# Altium schematic sheet Stack_B.SchDoc
size A4
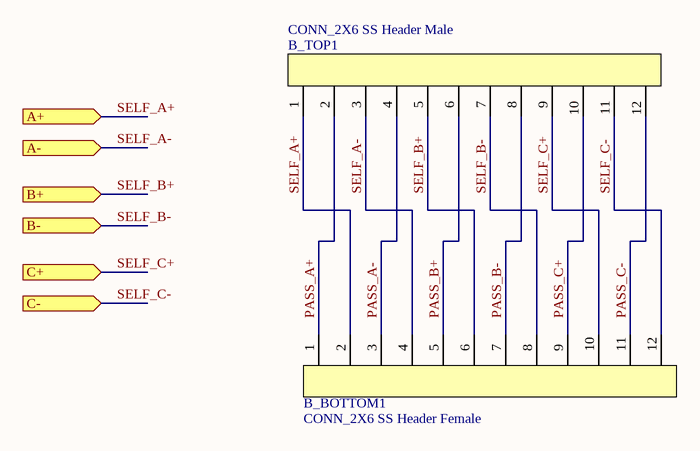
[diagram p0: Stack_B.SchDoc]

## Parts
B_BOTTOM1  CONN_2X6 SS Header Female  [SAMTEC_SSW-106-22-F-D-VS]
B_TOP1  CONN_2X6 SS Header Male  [SAMTEC_TSM-106-03-F-DV]

## Ports
A+ (in), A- (in), B+ (in), B- (in), C+ (in), C- (in)

## Nets
PASS_A+: B_BOTTOM1.1 B_TOP1.2
PASS_A-: B_BOTTOM1.3 B_TOP1.4
PASS_B+: B_BOTTOM1.5 B_TOP1.6
PASS_B-: B_BOTTOM1.7 B_TOP1.8
PASS_C+: B_BOTTOM1.9 B_TOP1.10
PASS_C-: B_BOTTOM1.11 B_TOP1.12
SELF_A+: B_BOTTOM1.2 B_TOP1.1 ; port A+
SELF_A-: B_BOTTOM1.4 B_TOP1.3 ; port A-
SELF_B+: B_BOTTOM1.6 B_TOP1.5 ; port B+
SELF_B-: B_BOTTOM1.8 B_TOP1.7 ; port B-
SELF_C+: B_BOTTOM1.10 B_TOP1.9 ; port C+
SELF_C-: B_BOTTOM1.12 B_TOP1.11 ; port C-

## Notes on the sheet
- Title
- Size:
- Date:
- A4
- Number:
- Time:
- Revision:
- Sheet
- of
- File:

## Library data of the parts
B_BOTTOM1 B_TOP1 = CONN_2X6 SS Header